# Altium schematic sheet Rev3b_Schematic.SchDoc
size A
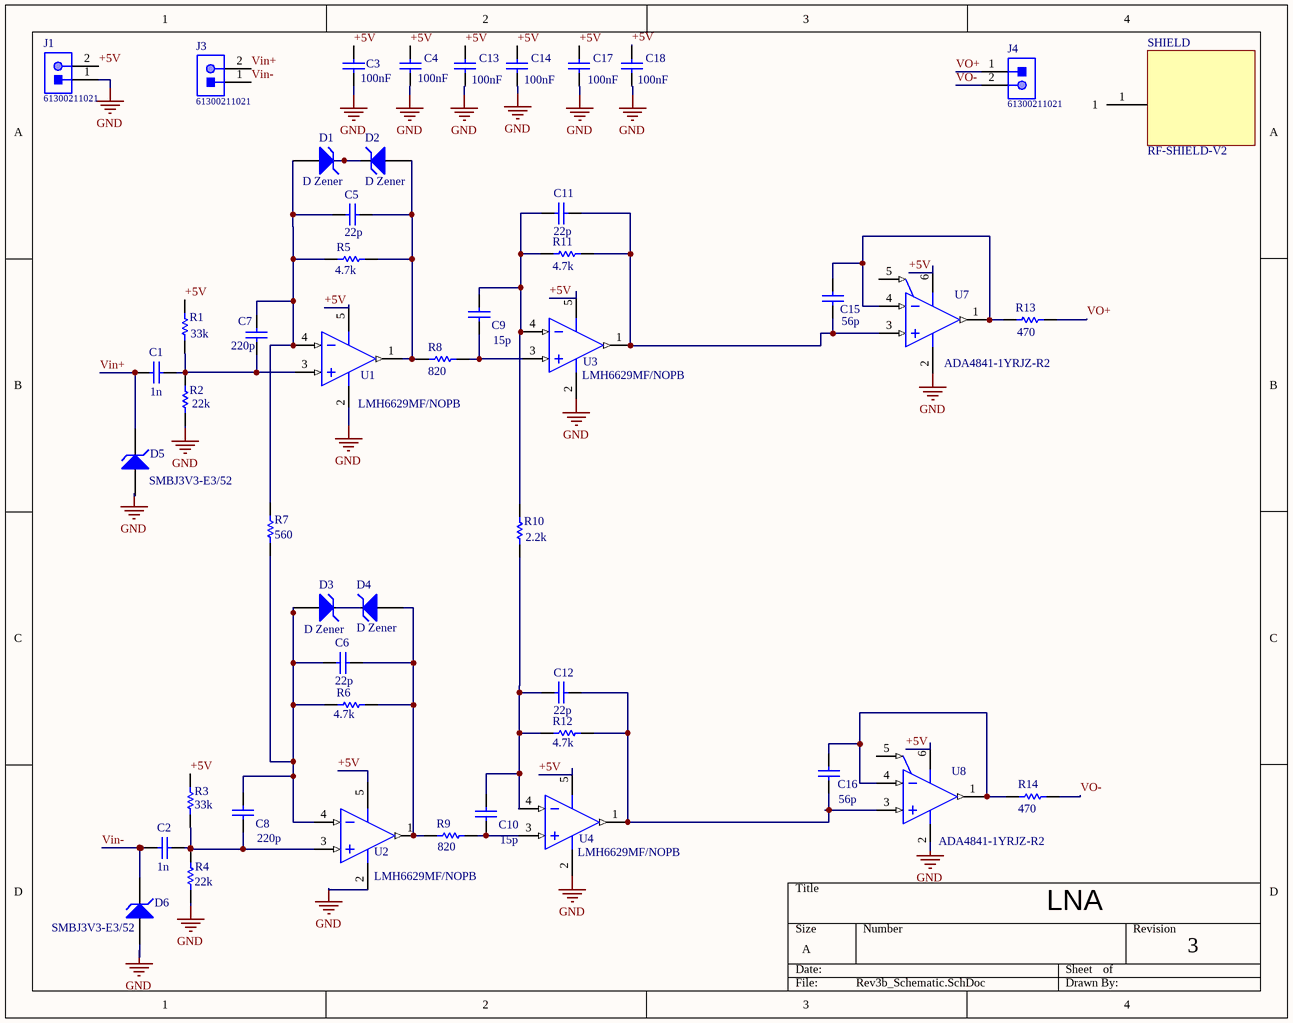
[diagram p0: Rev3b_Schematic.SchDoc]

## Parts
C1  value 1n  [*CAPC1608X90]
C2  value 1n  [*CAPC1608X90]
C3  value 100nF  [*CAPC1608X90]
C4  value 100nF  [*CAPC1608X90]
C5  22p  [CAPC1608X90X35LL10T15]
C6  22p  [CAPC1608X90X35LL10T15]
C7  220p  [CAPC1608X87X35NL15T15]
C8  220p  [CAPC1608X87X35NL15T15]
C9  15p  [CAPC1608X87X35NL15T15]
C10  15p  [CAPC1608X87X35NL15T15]
C11  22p  [CAPC1608X90X35LL10T15]
C12  22p  [CAPC1608X90X35LL10T15]
C13  value 100nF  [*CAPC1608X90]
C14  value 100nF  [*CAPC1608X90]
C15  56p  [CAPC1608X87X35NL15T15]
C16  56p  [CAPC1608X87X35NL15T15]
C17  value 100nF  [*CAPC1608X90]
C18  value 100nF  [*CAPC1608X90]
D1  D Zener  [J1-0603]
D2  D Zener  [J1-0603]
D3  D Zener  [J1-0603]
D4  D Zener  [J1-0603]
D5  SMBJ3V3-E3/52  [VISH-DO-214AA-2_V]
D6  SMBJ3V3-E3/52  [VISH-DO-214AA-2_V]
J1  61300211021  [61300211021]
J3  61300211021  [61300211021]
J4  61300211021  [61300211021]
R1  value 33k  [J1-0603]
R2  value 22k  [J1-0603]
R3  value 33k  [J1-0603]
R4  value 22k  [J1-0603]
R5  value 4.7k  [J1-0603]
R6  value 4.7k  [J1-0603]
R7  value 560  [J1-0603]
R8  value 820  [J1-0603]
R9  value 820  [J1-0603]
R10  value 2.2k  [J1-0603]
R11  value 4.7k  [J1-0603]
R12  value 4.7k  [J1-0603]
R13  value 470  [J1-0603]
R14  value 470  [J1-0603]
SHIELD  RF-SHIELD-V2  [RF-SHIELD-V2]
U1  LMH6629MF/NOPB  [DBV0005A_M]
U2  LMH6629MF/NOPB  [DBV0005A_M]
U3  LMH6629MF/NOPB  [DBV0005A_M]
U4  LMH6629MF/NOPB  [DBV0005A_M]
U7  ADA4841-1YRJZ-R2  [ADI-RJ-6_M]
U8  ADA4841-1YRJZ-R2  [ADI-RJ-6_M]

## Nets
GND: C3.1 C4.1 C13.1 C14.1 C17.1 C18.1 D5.1(A) D6.1(A) J1.1 R2.1 R4.1 U1.2(V-) U2.2(V-) U3.2(V-) U4.2(V-) U7.2(-VS) U8.2(-VS)
+5V: C3.2 C4.2 C13.2 C14.2 C17.2 C18.2 J1.2 R1.2 R3.2 U1.5(V+) U2.5(V+) U3.5(V+) U4.5(V+) U7.6(+VS) U8.6(+VS)
Vin+: C1.2 D5.2(K) J3.2
Vin-: C2.2 D6.2(K) J3.1
VO+: J4.1 R13.1
VO-: J4.2 R14.1
NetC1_1: C1.1 C7.1 R1.1 R2.2 U1.3(IN+)
NetC2_1: C2.1 C8.1 R3.1 R4.2 U2.3(IN+)
NetC5_1: C5.1 C7.2 D1.1(A) R5.1 R7.2 U1.4(IN-)
NetC5_2: C5.2 D2.1(A) R5.2 R8.1 U1.1(OUT)
NetC6_1: C6.1 C8.2 D3.1(A) R6.1 R7.1 U2.4(IN-)
NetC6_2: C6.2 D4.1(A) R6.2 R9.1 U2.1(OUT)
NetC9_1: C9.1 R8.2 U3.3(IN+)
NetC9_2: C9.2 C11.1 R10.2 R11.1 U3.4(IN-)
NetC10_1: C10.1 R9.2 U4.3(IN+)
NetC10_2: C10.2 C12.1 R10.1 R12.1 U4.4(IN-)
NetC11_2: C11.2 C15.1 R11.2 U3.1(OUT) U7.3(+IN)
NetC12_2: C12.2 C16.1 R12.2 U4.1(OUT) U8.3(+IN)
NetC15_2: C15.2 R13.2 U7.1(VOUT) U7.4(-IN)
NetC16_2: C16.2 R14.2 U8.1(VOUT) U8.4(-IN)
NetD1_2: D1.2(K) D2.2(K)
NetD3_2: D3.2(K) D4.2(K)

Not connected (* = marked no-connect by the designer): SHIELD 1; U7 5(~{POWER_DOWN}); U8 5(~{POWER_DOWN})

## Notes on the sheet
- LNA
- 3

## Library data of the parts
C1-C4 C13 C14 C17 C18 = Cap: Capacitor; Published: 8-Jun-2000; LatestRevisionDate: 17-Jul-2002; LatestRevisionNote: Re-released for DXP Platform.; PackageReference: RAD-0.3; Publisher: Altium Limited; PackageDescription: Radial Cap, Thru-Hole; 2 Leads; 0.3 in Pin Spacing
C5 C6 C11 C12 = CMP-2006-02592-1: Part Number: GRM1885C1H100JA01D; Manufacturer: Murata
C7-C10 C15 C16 = CMP-2006-03317-1: Part Number: C0603C331J5GACTU; Manufacturer: Kemet
D1-D4 = D Zener: Zener Diode; Published: 8-Jun-2000; LatestRevisionDate: 17-Jul-2002; LatestRevisionNote: Re-released for DXP Platform.; PackageReference: DIODE-0.7; Publisher: Altium Limited; PackageDescription: Diode, Thru-Hole; 2 Leads; 0.7 in Pin Spacing
D5 D6 = CMP-2000-07096-1: Surface Mount TRANSZORB(R) Transient Voltage Suppressor, 60 A, 4.1 V, -65 to 175 degC, 2-Pin SMD (DO-214AA), RoHS, Tape and Reel; Manufacturer: Vishay; Temperature, Operating: -65to175°C; Temperature, Operating, Minimum: -65°C; Temperature, Operating, Maximum: +175°C; Direction: Uni-Directional; Brand/Series: TransZorb®Series; Power Dissipation: 600W; Temperature, Operating, Range: -65to+175°C; Current, Leakage: 200μA; Capacitance: 5200pF; Current, Surge: 200A; Voltage, Clamping: 10.3V; Temperature, Junction, Maximum: 175°C; Type: TVS; Primary Type: Diodes; Configuration: Single; Voltage, Breakdown: 4.1V; Mounting Type: SurfaceMount; Package Type: DO-214AA; Termination: Solder; Mounting Technology: SurfaceMount; Package Reference: DO-214AA; Dimensions: 4.57x3.94x2.44mm; Length: 4.57mm; Datasheet Version: 12/2013; Datasheet URL: http://datasheet.octopart.com/SMBJ3V3-E3-52-Vishay-datasheet-62319170.pdf; Manufacturer URL: http://www.vishay.com/; Height: 2.44mm; Width: 3.94mm; Current, Ratings: 200A; Weight: 0.096g; Package Description: 2-Pin Surface Mount Device, Body 4.315 x 3.62 mm; Suppressor Type: Voltage
J1 J3 J4 = CMP-1502-01059-1: THT Angled Pin Header WR-PHD, Pitch 2.54 mm, Single Row, 2 pins; Manufacturer: Wurth Elektronik; Withstanding Voltage: 500VAC; Gender: Male; Pitch: 2.54mm; Pin Number: 2; Rated Current: 3A; Contact Resistance: 20mOhm; Working Voltage: 250VAC; Mounting Technology: THT; Part Number: 61300211021; Manufacturer URL: http://www.we-online.de; Operating Temperature: -40to105degC; Row Number: Single; Publisher: WurthElektronik; Orientation: Angled; Datasheet URL: https://katalog.we-online.de/em/datasheet/6130xx11021.pdf; Packaging: Bag; Package Reference: 61300211021
R1-R14 = Res1: Resistor; Published: 8-Jun-2000; LatestRevisionDate: 17-Jul-2002; LatestRevisionNote: Re-released for DXP Platform.; PackageReference: AXIAL-0.3; Publisher: Altium Limited; PackageDescription: Axial Device, Thru-Hole; 2 Leads; 0.3 in Pin Spacing
U1-U4 = CMP-0055-01620-3: Ultra-Low Noise, High-Speed Operational Amplifier with Shutdown, 5-pin SOT-23, 1000 Reel; Manufacturer: Texas Instruments; PackageTopMarking: AE7A*XTT; High-Reliability: Y; CompType: Amplifiers; ComponentLink1URL: http://www.ti.com/general/docs/lit/getliterature.tsp?genericPartNumber=LMH6629&fileType=pdf; PinCount: 5; Package Reference: DBV0005A; RoHS: Y; PowerWise: Y; PackageDescription: Molded SOT-23, .115 x .063 x .040 in Body, 5 Lead, .0375 in Pitch; PartNumber: LMH6629MF/NOPB; ComponentLink1Description: Datasheet URL
U7 U8 = CMP-0384-01553-2: Single Channel Low Wide Band Noise Operational Amplifier, 80 MHz BW, 13 V/us SR, Industrial, 6-pin SOT23 (RJ-6), Reel; Manufacturer: Analog Devices; Slew Rate: 13V/us; Small Signal Bandwidth: 80MHz; Input Offset Voltage: 40uV; V Span Min: 2.7V; Iq/Amp: 1.5mA; V Span Max: 12V; Amplifiers Per Package: 1; Input Bias Current: 3uA; ComponentLink2URL: http://www.analog.com/static/imported-files/data_sheets/ADA4841-1_4841-2.pdf; Code_JEDEC: MO-178-AB; PartNumber: ADA4841-1YRJZ-R2; ComponentLink1URL: http://www.analog.com/en/index.html; ComponentLink2Description: Datasheet; ComponentLink3Description: Package Specification; ComponentLink4Description: Reference Circuit; Mounting Technology: Surface Mount; RevisionNote: Reference Circuit URL fixed; PackageReference: RJ-6; ComponentLink4URL: http://www.analog.com/en/all-operational-amplifiers-op-amps/operational-amplifiers-op-amps/ada4841-1/products/product.html#product-recommendations; PackageDescription: 6-Pin Small Outline Transistor Package, Body 2.9 x 1.6 mm, Pitch 0.95 mm; ComponentLink1Description: Manufacturer URL; DatasheetVersion: Rev. E; PackageVersion: 121608-A; ComponentLink3URL: http://www.analog.com/static/imported-files/packages/PKG_PDF/SOT-23(RJ)/RJ_6.pdf; Generic Part Number: ADA4841-1